# Altium schematic sheet 5_FLASH.SchDoc
size A4
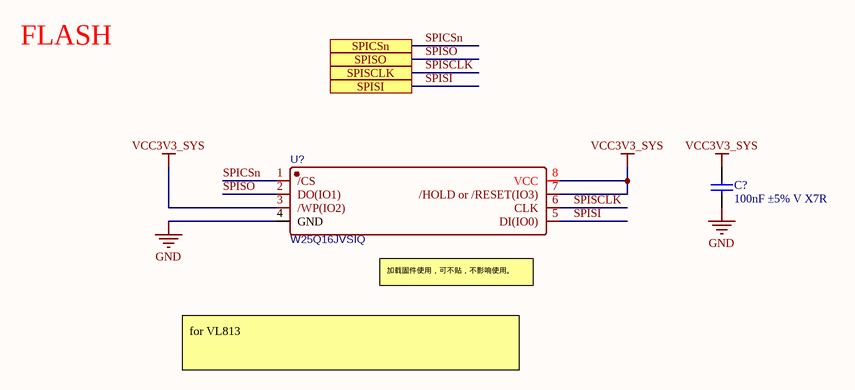
[diagram p0: 5_FLASH.SchDoc]

## Parts
C?  100nF ±5% V X7R  [C0402]
U?  W25Q16JVSIQ  [SOIC-8_L5.3-W5.3-P1.27-LS8.0-BL]

## Ports
SPICSn, SPISCLK, SPISI, SPISO

## Nets
GND: C?.1 U?.4(GND)
VCC3V3_SYS: C?.2 U?.3(/WP(IO2)) U?.7(/HOLD_or_/RESET(IO3)) U?.8(VCC)
SPICSn: U?.1(/CS) ; port SPICSn
SPISCLK: U?.6(CLK) ; port SPISCLK
SPISI: U?.5(DI(IO0)) ; port SPISI
SPISO: U?.2(DO(IO1)) ; port SPISO

## Notes on the sheet
- FLASH
- (near U?) 加载固件使用，可不贴，不影响使用。
- for VL813

## Library data of the parts
C? = C0402: Capacitor; Published: 8-Jun-2000; LatestRevisionDate: 17-Jul-2002; LatestRevisionNote: Re-released for DXP Platform.; PackageReference: RAD-0.3; Publisher: Altium Limited; PackageDescription: Radial Cap, Thru-Hole; 2 Leads; 0.3 in Pin Spacing
U? = W25Q16FWSSIQ: BOM_Manufacturer: Winbond Elec; Contributor: LCSC; BOM_Supplier: LCSC; BOM_Supplier Part: C377629; BOM_Manufacturer Part: W25Q16FWSSIQ; BOM_JLCPCB Part Class: Extended Part; spicePre: U; spiceSymbolName: W25Q16FWSSIQ